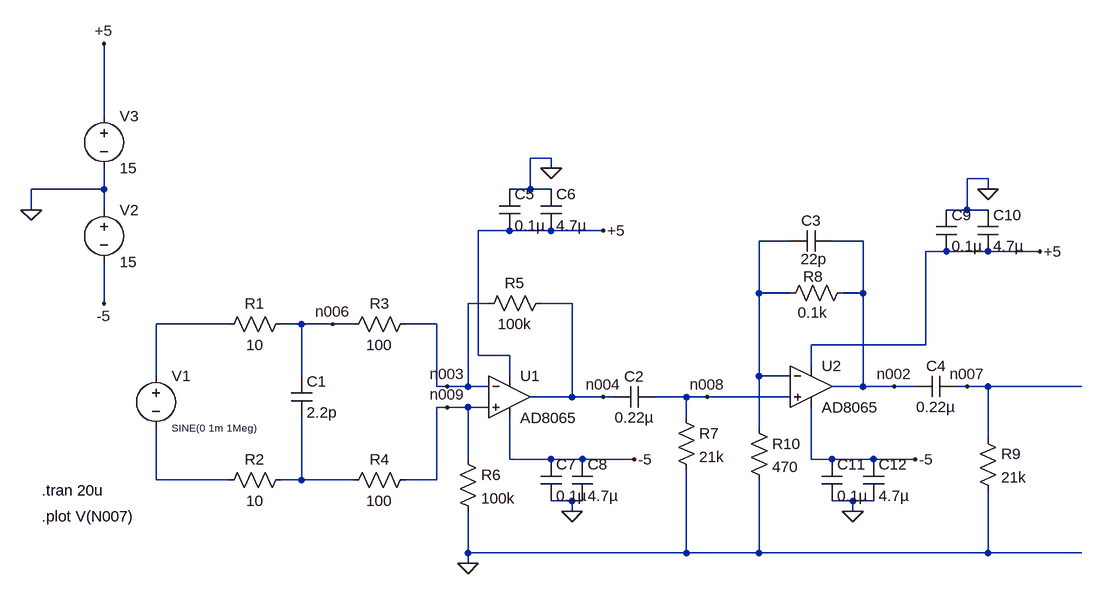
[diagram p0: schematic Rogowski_Integrator.asc]
Rogowski_Integrator.asc, the LTspice schematic file:
Version 4.1
SHEET 1 1188 680
WIRE -384 -288 -384 -400
WIRE 304 -224 272 -224
WIRE 304 -208 304 -224
WIRE 976 -192 944 -192
WIRE -384 -176 -384 -208
WIRE -384 -176 -496 -176
WIRE 272 -176 272 -224
WIRE 272 -176 240 -176
WIRE 304 -176 272 -176
WIRE 976 -176 976 -192
WIRE -496 -144 -496 -176
WIRE -384 -144 -384 -176
WIRE 944 -144 944 -192
WIRE 944 -144 912 -144
WIRE 976 -144 944 -144
WIRE 240 -112 192 -112
WIRE 304 -112 240 -112
WIRE 384 -112 304 -112
WIRE 672 -96 624 -96
WIRE 784 -96 736 -96
WIRE 912 -80 880 -80
WIRE 976 -80 912 -80
WIRE 1056 -80 976 -80
WIRE 624 -16 624 -96
WIRE 672 -16 624 -16
WIRE 784 -16 784 -96
WIRE 784 -16 752 -16
WIRE -384 0 -384 -64
WIRE 208 0 176 0
WIRE 336 0 288 0
WIRE -192 32 -304 32
WIRE -80 32 -112 32
WIRE -32 32 -80 32
WIRE 0 32 -32 32
WIRE 128 32 80 32
WIRE 880 64 880 -80
WIRE 880 64 704 64
WIRE 192 80 192 -112
WIRE 240 80 192 80
WIRE 704 96 704 64
WIRE -304 112 -304 32
WIRE -80 112 -80 32
WIRE 240 112 240 80
WIRE 624 112 624 -16
WIRE 672 112 624 112
WIRE 128 128 128 32
WIRE 144 128 128 128
WIRE 176 128 176 0
WIRE 176 128 144 128
WIRE 208 128 176 128
WIRE 784 128 784 -16
WIRE 784 128 736 128
WIRE 832 128 784 128
WIRE 864 128 832 128
WIRE 944 128 928 128
WIRE 976 128 944 128
WIRE 1120 128 976 128
WIRE 336 144 336 0
WIRE 336 144 272 144
WIRE 384 144 336 144
WIRE 400 144 384 144
WIRE 512 144 464 144
WIRE 544 144 512 144
WIRE 672 144 544 144
WIRE 144 160 128 160
WIRE 176 160 144 160
WIRE 208 160 176 160
WIRE 512 176 512 144
WIRE 624 192 624 112
WIRE 976 208 976 128
WIRE 176 240 176 160
WIRE 240 240 240 176
WIRE 304 240 240 240
WIRE 352 240 304 240
WIRE 432 240 352 240
WIRE 704 240 704 160
WIRE 736 240 704 240
WIRE 800 240 736 240
WIRE 864 240 800 240
WIRE -304 272 -304 192
WIRE -192 272 -304 272
WIRE -80 272 -80 176
WIRE -80 272 -112 272
WIRE 0 272 -80 272
WIRE 128 272 128 160
WIRE 128 272 80 272
WIRE 336 304 304 304
WIRE 352 304 336 304
WIRE 768 304 736 304
WIRE 800 304 768 304
WIRE 336 320 336 304
WIRE 768 320 768 304
WIRE 176 384 176 320
WIRE 512 384 512 256
WIRE 512 384 176 384
WIRE 624 384 624 272
WIRE 624 384 512 384
WIRE 976 384 976 288
WIRE 976 384 624 384
WIRE 1120 384 976 384
WIRE 176 400 176 384
FLAG -496 -144 0
FLAG -384 -400 +5
FLAG 176 400 0
FLAG 304 -208 0
FLAG 384 -112 +5
FLAG 336 320 0
FLAG 976 -176 0
FLAG 1056 -80 +5
FLAG 768 320 0
FLAG -384 0 -5
FLAG 864 240 -5
FLAG 384 144 n004
FLAG 144 128 n003
FLAG 144 160 n009
FLAG -32 32 n006
FLAG 944 128 n007
FLAG 432 240 -5
FLAG 544 144 n008
FLAG 832 128 n002
SYMBOL OpAmps\\AD8065 240 80 R0
SYMATTR InstName U1
SYMBOL voltage -304 96 R0
WINDOW 123 0 0 Left 0
WINDOW 39 0 0 Left 0
WINDOW 3 24 96 Left 1
SYMATTR Value SINE(0 1m 1Meg)
SYMATTR InstName V1
SYMBOL voltage -384 -160 R0
WINDOW 123 0 0 Left 0
WINDOW 39 0 0 Left 0
SYMATTR InstName V2
SYMATTR Value 15
SYMBOL voltage -384 -304 R0
WINDOW 123 0 0 Left 0
WINDOW 39 0 0 Left 0
SYMATTR InstName V3
SYMATTR Value 15
SYMBOL res -96 16 R90
WINDOW 0 0 56 VBottom 2
WINDOW 3 32 56 VTop 2
SYMATTR InstName R1
SYMATTR Value 10
SYMATTR SpiceLine tol=1 pwr=0.1
SYMBOL res -96 256 R90
WINDOW 0 0 56 VBottom 2
WINDOW 3 32 56 VTop 2
SYMATTR InstName R2
SYMATTR Value 10
SYMATTR SpiceLine tol=1 pwr=0.1
SYMBOL cap -96 112 R0
SYMATTR InstName C1
SYMATTR Value 2.2p
SYMATTR SpiceLine V=100 Irms=0 Rser=0 Lser=0
SYMBOL res 96 16 R90
WINDOW 0 0 56 VBottom 2
WINDOW 3 32 56 VTop 2
SYMATTR InstName R3
SYMATTR Value 100
SYMATTR SpiceLine tol=1 pwr=0.1
SYMBOL res 96 256 R90
WINDOW 0 0 56 VBottom 2
WINDOW 3 32 56 VTop 2
SYMATTR InstName R4
SYMATTR Value 100
SYMATTR SpiceLine tol=1 pwr=0.1
SYMBOL res 304 -16 R90
WINDOW 0 0 56 VBottom 2
WINDOW 3 32 56 VTop 2
SYMATTR InstName R5
SYMATTR Value 100k
SYMATTR SpiceLine tol=1 pwr=0.1
SYMBOL res 160 224 R0
SYMATTR InstName R6
SYMATTR Value 100k
SYMATTR SpiceLine tol=1 pwr=0.1
SYMBOL cap 464 128 R90
WINDOW 0 0 32 VBottom 2
WINDOW 3 32 32 VTop 2
SYMATTR InstName C2
SYMATTR Value 0.22µ
SYMATTR SpiceLine V=4 Irms=3.56 Rser=0.0381287 Lser=0 mfg="KEMET" pn="C0402C224K7PAC" type="X5R"
SYMBOL res 496 160 R0
SYMATTR InstName R7
SYMATTR Value 21k
SYMATTR SpiceLine tol=1 pwr=0.1
SYMBOL OpAmps\\AD8065 704 64 R0
SYMATTR InstName U2
SYMBOL res 768 -32 R90
WINDOW 0 6 61 VBottom 2
WINDOW 3 30 62 VTop 2
SYMATTR InstName R8
SYMATTR Value 0.1k
SYMATTR SpiceLine tol=1 pwr=0.1
SYMBOL cap 736 -112 R90
WINDOW 0 0 32 VBottom 2
WINDOW 3 28 28 VTop 2
SYMATTR InstName C3
SYMATTR Value 22p
SYMATTR SpiceLine V=100 Irms=0 Rser=0 Lser=0
SYMBOL cap 928 112 R90
WINDOW 0 0 32 VBottom 2
WINDOW 3 32 32 VTop 2
SYMATTR InstName C4
SYMATTR Value 0.22µ
SYMATTR SpiceLine V=4 Irms=3.56 Rser=0.0381287 Lser=0 mfg="KEMET" pn="C0402C224K7PAC" type="X5R"
SYMBOL res 960 192 R0
SYMATTR InstName R9
SYMATTR Value 21k
SYMATTR SpiceLine tol=1 pwr=0.1
SYMBOL res 608 176 R0
SYMATTR InstName R10
SYMATTR Value 470
SYMATTR SpiceLine tol=1 pwr=0.1
SYMBOL cap 224 -176 R0
SYMATTR InstName C5
SYMATTR Value 0.1µ
SYMBOL cap 288 -176 R0
SYMATTR InstName C6
SYMATTR Value 4.7µ
SYMATTR SpiceLine V=2.5 Irms=0 Rser=0 Lser=0 mfg="Murata" pn="GRM155R60E475ME76" type="X5R"
SYMBOL cap 288 240 R0
SYMATTR InstName C7
SYMATTR Value 0.1µ
SYMBOL cap 336 240 R0
SYMATTR InstName C8
SYMATTR Value 4.7µ
SYMBOL cap 896 -144 R0
SYMATTR InstName C9
SYMATTR Value 0.1µ
SYMBOL cap 960 -144 R0
SYMATTR InstName C10
SYMATTR Value 4.7µ
SYMBOL cap 720 240 R0
SYMATTR InstName C11
SYMATTR Value 0.1µ
SYMBOL cap 784 240 R0
SYMATTR InstName C12
SYMATTR Value 4.7µ
TEXT -480 288 Left 2 !.tran 20u
TEXT -480 328 Left 2 !.plot V(N007)

The netlist it stands for:
* Rogowski_Integrator.asc
X§U1 n009 n003 +5 -5 n004 AD8065  ; pins In+ In- V+ V- OUT
V1 N005 N010 SINE(0 1m 1Meg)
V2 0 -5 15
V3 +5 0 15
R1 n006 N005 10 tol=1 pwr=0.1
R2 N011 N010 10 tol=1 pwr=0.1
C1 n006 N011 2.2p V=100 Irms=0 Rser=0 Lser=0
R3 n003 n006 100 tol=1 pwr=0.1
R4 n009 N011 100 tol=1 pwr=0.1
R5 n004 n003 100k tol=1 pwr=0.1
R6 n009 0 100k tol=1 pwr=0.1
C2 n008 n004 0.22µ V=4 Irms=3.56 Rser=0.0381287 Lser=0 mfg="KEMET" pn="C0402C224K7PAC" type="X5R"
R7 n008 0 21k tol=1 pwr=0.1
X§U2 n008 N001 +5 -5 n002 AD8065  ; pins In+ In- V+ V- OUT
R8 n002 N001 0.1k tol=1 pwr=0.1
C3 n002 N001 22p V=100 Irms=0 Rser=0 Lser=0
C4 n007 n002 0.22µ V=4 Irms=3.56 Rser=0.0381287 Lser=0 mfg="KEMET" pn="C0402C224K7PAC" type="X5R"
R9 n007 0 21k tol=1 pwr=0.1
R10 N001 0 470 tol=1 pwr=0.1
C5 0 +5 0.1µ
C6 0 +5 4.7µ V=2.5 Irms=0 Rser=0 Lser=0 mfg="Murata" pn="GRM155R60E475ME76" type="X5R"
C7 -5 0 0.1µ
C8 -5 0 4.7µ
C9 0 +5 0.1µ
C10 0 +5 4.7µ
C11 -5 0 0.1µ
C12 -5 0 4.7µ
.tran 20u
.plot V(N007)
.backanno
.end